# EAGLE board BenchPsu (EAGLE 6.6.0), part 1 of 2
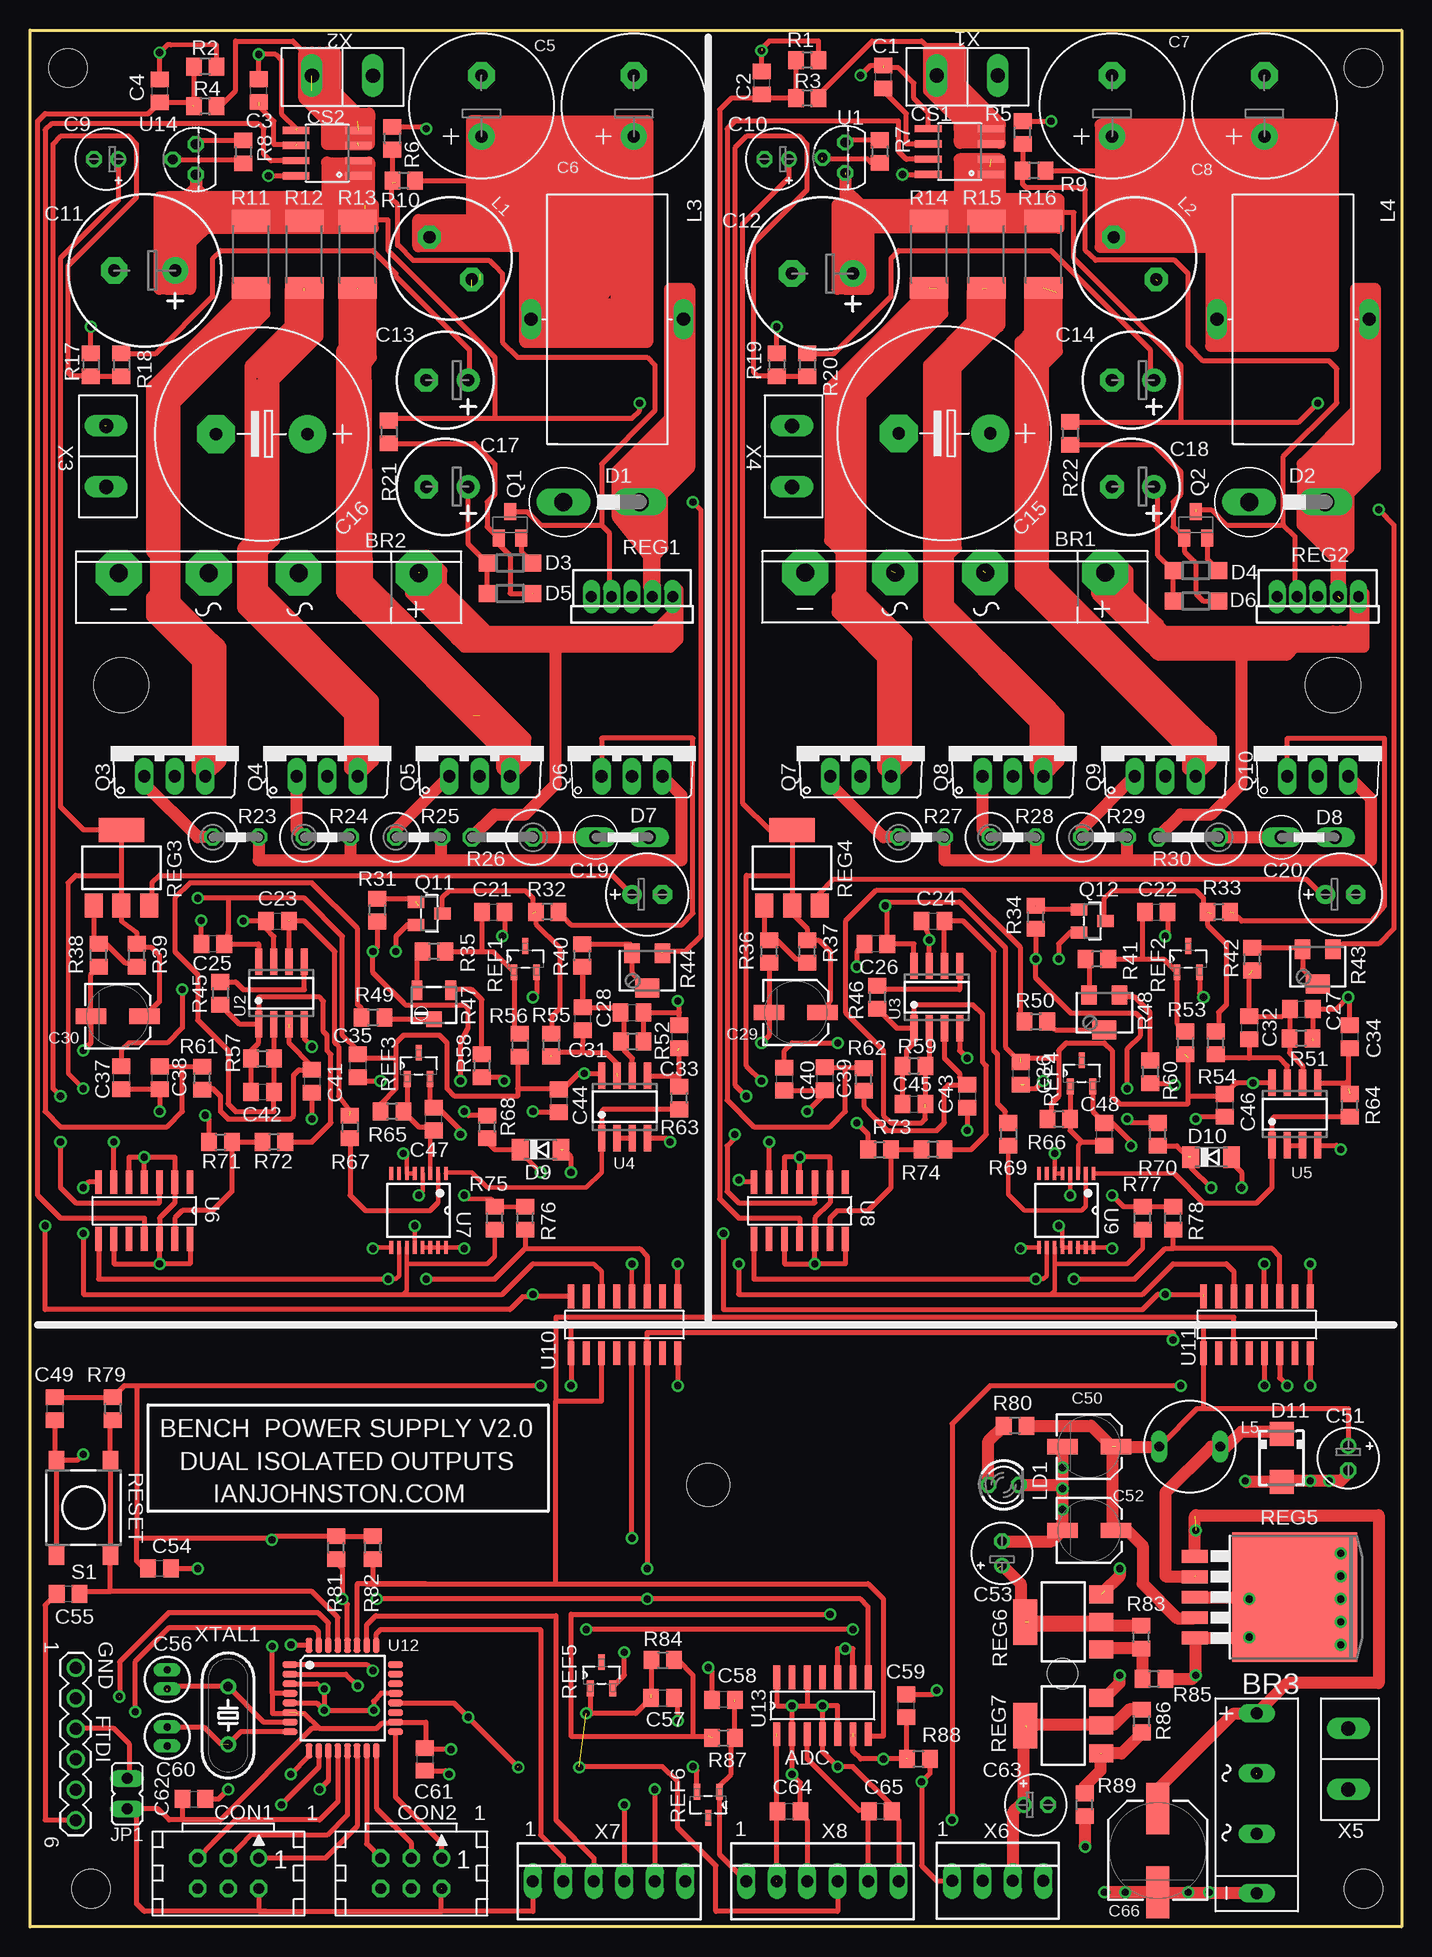
[diagram p2: board, top side]
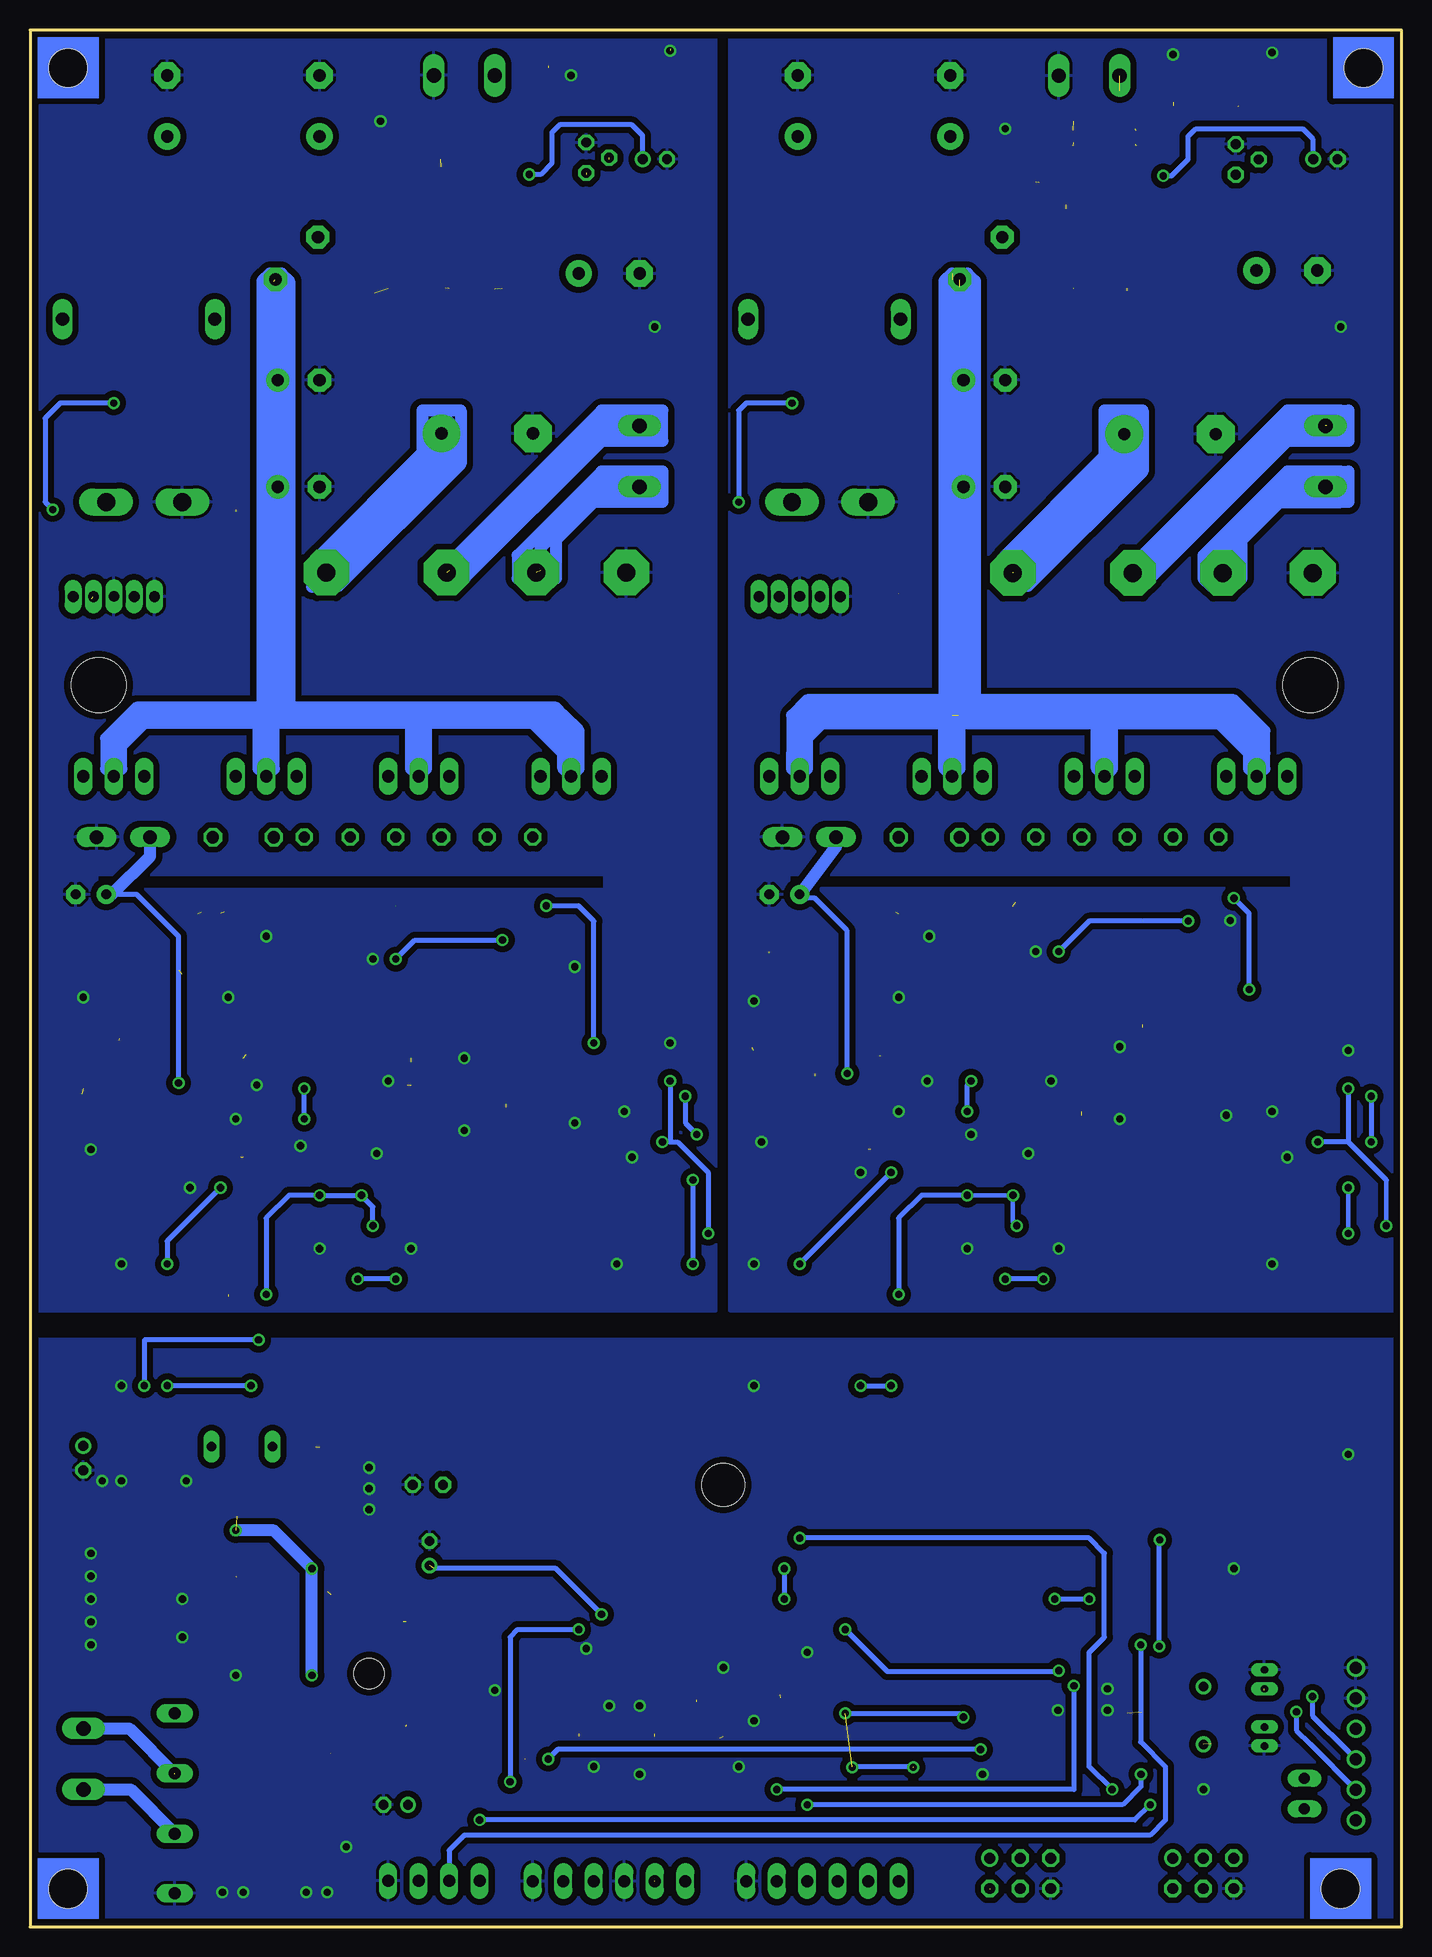
[diagram p3: board, bottom side, seen from below]

Size 114.3 x 158.11 mm. Coordinates in mm from the lower left corner, seen from the top.
Outline: 114.3,158.12 114.3,0 0,0 0,158.12 114.3,158.12
Copper layers (1*16): Top 0.035mm / dielectric 1.5mm / Bottom 0.035mm
Design rules "default": minimum track width 10mil, minimum drill 24mil, track to track 20mil, track to pad 20mil, pad to pad 20mil, via to via 20mil, smd to smd 20mil, copper to edge 22mil, drill to drill 8mil, minimum pad ring 10mil, minimum via ring 8mil, stop-mask expansion 4mil, vias tented up to drill 0mil, thermal gap 10mil
Net classes: 1 vcc: width 0.254 mm; 2 gnd: width 0.254 mm, drill 0.61 mm, clearance 0.254 mm; 3 usbvcc: width 0.254 mm, drill 0.61 mm, clearance 0.254 mm; 4 aref: width 0.254 mm, drill 0.61 mm, clearance 0.254 mm
Holes 3.2 mm at 5.08,3.18 3.17,154.94 111.12,154.94 111.12,3.18
Holes 4.57 mm at 108.58,103.51 7.62,103.51
Holes 3.56 mm at 56.52,36.83
Holes 2.54 mm at 86.04,21.11

## Footprints (pad centres in the part's own frame; a part is rotated, then mirrored left to right if it is on the bottom)
GSIB_15A = drill 1.5 pad 3.81 octagon: + -13.5,-1.27; - 11.494,-1.27; AC1 -3.492,-1.27; AC2 4.001,-1.27
2KBB-R = drill 1.016 long: + -7.62,0; - 7.391,0; AC1 -2.616,0; AC2 2.413,0
C0805 = smd 1.3 x 1.5: 1 -0.95,0; 2 0.95,0
E5,0-12 = drill 1.016 pad 2.184: + -2.54,0 | drill 1.016 pad 2.184 octagon: - 2.54,0
E2-5 = drill 0.813 pad 1.27: + -1.016,0 | drill 0.813 pad 1.27 octagon: - 1.016,0
E-050X125 = drill 1.016 pad 2.184: + -2.54,0 | drill 1.016 pad 2.184 octagon: - 2.54,0
E-035X080 = drill 1.016 pad 1.93: + -1.905,0 | drill 1.016 pad 1.93 octagon: - 1.587,0
E7,5-18 = drill 1.016 pad 3.15: + -3.81,0 | drill 1.016 pad 3.15 octagon: - 3.81,0
E2,5-7 = drill 0.813 pad 1.6: + -1.27,0 | drill 0.813 pad 1.6 octagon: - 1.27,0
SV-C = smd 2.54 x 1.27: + -2.223,0; - 2.223,0
ENP-015-040 = drill 0.61 pad 0.813 long: 1 -0.635,0; 2 0.953,0
SV-E/F = smd 4.318 x 1.93: + -3.493,0; - 3.493,0
CON06 = drill 0.914: 1 -2.54,-1.27 | drill 0.914 octagon: 2 -2.54,1.27; 3 0,-1.27; 4 0,1.27; 5 2.54,-1.27; 6 2.54,1.27
SO08 = smd 0.61 x 2.21: 1 -1.905,-2.616; 2 -0.635,-2.616; 3 0.635,-2.616; 4 1.905,-2.616; 5 1.905,2.616; 6 0.635,2.616; 7 -0.635,2.616; 8 -1.905,2.616
DO-201-15_V = drill 1.499 long: A 5.08,0; C -1.27,0
SOD123 = smd 1.4 x 1.4: A 1.9,0; C -1.9,0
D015-12_V = drill 1.118 long: A 4.445,0; C 0,0
SOD80C = smd 1.4 x 1.8: A 1.7,0; C -1.7,0
SMA = smd 2 x 2: A 2,0; C -2,0
1X06 = drill 1.016: 1 0,0; 2 2.54,0; 3 5.08,0; 4 7.62,0; 5 10.16,0; 6 12.7,0
JP1 = drill 0.914 long: 1 0,-1.27; 2 0,1.27
RS749-8366_THT22UH = drill 1.016 pad 1.93 octagon: 1 -2.5,0; 2 2.5,0
SFT1030 = drill 1.118 long: 1 -6.35,0; 2 6.35,0
0.2PIN_0.3DIA = drill 0.813 long: 1 0,2.54; 2 0,-2.54
LED3MM = drill 0.813 octagon: A -1.27,0; K 1.27,0
SOT23-BEC = smd 1 x 1.4: B -0.95,-1.1; C 0,1.1; E 0.95,-1.1
TO220AV = drill 1.016 long: B -2.54,-2.54; C 0,-2.54; E 2.54,-2.54
TO220V = drill 1.016 long: 1 -2.54,-2.54; 2 0,-2.54; 3 2.54,-2.54
SOT23 = smd 1 x 1.4: 1 -0.95,-1.1; 2 0.95,-1.1; 3 0,1.1
R0805 = smd 1.3 x 1.5: 1 -0.95,0; 2 0.95,0
R2512 = smd 1.8 x 3.2: 1 -2.8,0; 2 2.8,0
0411V = drill 0.914 octagon: 1 -2.54,0; 2 1.27,0
P0613V = drill 1.016 octagon: 1 -2.54,0; 2 2.54,0
SM-42/43W = smd 1.3 x 1.6: 1 -1.27,-1.45; 3 1.27,-1.45 | smd 2 x 1.6: 2 0,1.45
3223W = smd 0.9 x 1.6: 1 -1.4,-1.215; 3 1.4,-1.215 | smd 1.3 x 1.3: 2 0,1.215
SOT95P237X112-3N = smd 1.321 x 0.559: 1 -1.092,0.94; 2 -1.092,-0.94 | smd 1.321 x 0.508: 3 1.092,0
LM2575HV_V_2 = drill 0.9 long: 1 -3.389,0.258; 2 -1.7,0.263; 3 0.011,0.247; 4 1.7,0.263; 5 3.389,0.258
SOT223 = smd 1.5 x 2: 1 -2.3,-3.15; 2 0,-3.15; 3 2.3,-3.15 | smd 3.8 x 2: 4 0,3.15
TO263-5 = smd 1.067 x 2.159: 1 -3.404,-8.331; 2 -1.702,-8.331; 3 0,-8.331; 4 1.702,-8.331; 5 3.404,-8.331 | smd 10.8 x 10.41: 6 0,0
DTSM-6 = smd 1.55 x 1.3: 1 -3.975,2.25; 2 3.975,2.25; 3 -3.975,-2.25; 4 3.975,-2.25
TO92 = drill 0.813 octagon: 1 -1.27,0; 2 0,1.905; 3 1.27,0
SO08' = smd 0.6 x 2.2: 1 -1.905,-2.6; 2 -0.635,-2.6; 3 0.635,-2.6; 4 1.905,-2.6; 5 1.905,2.6; 6 0.635,2.6; 7 -0.635,2.6; 8 -1.905,2.6
SOIC127P600X175-14N = smd 1.981 x 0.559: 1 -2.362,3.81; 2 -2.362,2.54; 3 -2.362,1.27; 4 -2.362,0; 5 -2.362,-1.27; 6 -2.362,-2.54; 7 -2.362,-3.81; 8 2.362,-3.81; 9 2.362,-2.54; 10 2.362,-1.27; 11 2.362,0; 12 2.362,1.27; 13 2.362,2.54; 14 2.362,3.81
TSSOP16 = smd 0.31 x 1.1: 1 -2.275,-3.08; 2 -1.625,-3.08; 3 -0.975,-3.08; 4 -0.325,-3.08; 5 0.325,-3.08; 6 0.975,-3.08; 7 1.625,-3.08; 8 2.275,-3.08; 9 2.275,3.08; 10 1.625,3.08; 11 0.975,3.08; 12 0.325,3.08; 13 -0.325,3.08; 14 -0.975,3.08; 15 -1.625,3.08; 16 -2.275,3.08
SOIC16N = smd 1.981 x 0.559: 1 -2.362,3.81; 2 -2.362,2.54; 3 -2.362,1.27; 4 -2.362,0; 5 -2.362,-1.27; 6 -2.362,-2.54; 7 -2.362,-3.81; 8 -2.362,-5.08; 9 2.362,-5.08; 10 2.362,-3.81; 11 2.362,-2.54; 12 2.362,-1.27; 13 2.362,0; 14 2.362,1.27; 15 2.362,2.54; 16 2.362,3.81
TQFP32A = smd 1.27 x 0.559: 1 -4.4,2.8; 2 -4.4,2; 3 -4.4,1.2; 4 -4.4,0.4; 5 -4.4,-0.4; 6 -4.4,-1.2; 7 -4.4,-2; 8 -4.4,-2.8; 17 4.4,-2.8; 18 4.4,-2; 19 4.4,-1.2; 20 4.4,-0.4; 21 4.4,0.4; 22 4.4,1.2; 23 4.4,2; 24 4.4,2.8 | smd 0.559 x 1.27: 9 -2.8,-4.4; 10 -2,-4.4; 11 -1.2,-4.4; 12 -0.4,-4.4; 13 0.4,-4.4; 14 1.2,-4.4; 15 2,-4.4; 16 2.8,-4.4; 25 2.8,4.4; 26 2,4.4; 27 1.2,4.4; 28 0.4,4.4; 29 -0.4,4.4; 30 -1.2,4.4; 31 -2,4.4; 32 -2.8,4.4
W237-132 = drill 1.194 long: 1 -2.54,-0.635; 2 2.54,-0.635
22-23-2041 = drill 1 long: 1 -3.81,0; 2 -1.27,0; 3 1.27,0; 4 3.81,0
22-23-2061 = drill 1 long: 1 -6.35,0; 2 -3.81,0; 3 -1.27,0; 4 1.27,0; 5 3.81,0; 6 6.35,0
HC49/S@1 = drill 0.813: 1 -2.413,0; 2 2.413,0

## Placement (x,y rotation side)
BR1  15A 600V  [GSIB_15A]  76.1,111.63 180 top
BR2  15A 600V  [GSIB_15A]  18.89,111.59 180 top
BR3  2KBB05R  [2KBB-R]  102.23,10.18 270 top
C1  0.1uF  [C0805]  71.12,154.2 90 top
C2  0.1uF  [C0805]  60.96,153.69 270 top
C3  0.1uF  [C0805]  19.05,153.06 90 top
C4  0.1uF  [C0805]  10.79,153.03 270 top
C5  1000uF 50V  [E5,0-12]  37.62,151.79 90 top
C6  1000uF 50V  [E5,0-12]  50.32,151.79 90 top
C7  1000uF 50V  [E5,0-12]  90.17,151.79 90 top
C8  1000uF 50V  [E5,0-12]  102.87,151.79 90 top
C9  0.1uF  [E2-5]  6.35,147.34 180 top
C10  0.1uF  [E2-5]  62.23,147.34 180 top
C11  100uF 50V  [E-050X125]  9.56,138.07 180 top
C12  100uF 50V  [E-050X125]  66.04,137.82 180 top
C13  100uF 50V  [E-035X080]  34.61,128.93 180 top
C14  100uF 50V  [E-035X080]  91.76,128.93 180 top
C15  3300uF 50V  [E7,5-18]  76.2,124.48 180 top
C16  3300uF 50V  [E7,5-18]  19.31,124.44 180 top
C17  100uF 50V  [E-035X080]  34.61,120.04 180 top
C18  100uF 50V  [E-035X080]  91.76,120.04 180 top
C19  47uF 63V  [E2,5-7]  51.44,86.06 0 top
C20  47uF 63V  [E2,5-7]  109.22,86.06 0 top
C21  .1uF  [C0805]  38.61,84.6 0 top
C22  .1uF  [C0805]  93.85,84.6 0 top
C23  10n  [C0805]  20.63,83.84 0 top
C24  10n  [C0805]  75.25,83.84 0 top
C25  0.1uF  [C0805]  15.24,81.94 180 top
C26  0.1uF  [C0805]  70.48,81.94 180 top
C27  470pF  [C0805]  105.95,76.52 0 top
C28  470pF  [C0805]  50.16,76.22 0 top
C29  47uF 16V  [SV-C]  63.82,76.22 180 top
C30  47uF 16V  [SV-C]  7.3,75.9 180 top
C31  470pF  [C0805]  46.05,75.71 270 top
C32  470pF  [C0805]  101.6,74.95 270 top
C33  .1uF  [C0805]  54.12,74.19 270 top
C34  .1uF  [C0805]  109.98,74.19 270 top
C35  0.1uF  [C0805]  27.3,71.78 270 top
C36  0.1uF  [C0805]  82.55,71.14 270 top
C37  0.1uF  [C0805]  7.6,70.78 270 top
C38  0.1uF  [C0805]  10.79,70.77 270 top
C39  0.1uF  [C0805]  66.23,70.7 270 top
C40  0.1uF  [C0805]  62.87,70.67 270 top
C41  .1uF  [C0805]  23.5,70.48 270 top
C42  0.1uF  [C0805]  19.37,69.61 0 top
C43  .1uF  [C0805]  78.11,69.24 270 top
C44  .1uF  [C0805]  44.07,68.86 270 top
C45  0.1uF  [C0805]  73.66,68.6 0 top
C46  .1uF  [C0805]  99.57,68.48 270 top
C47  .1uF  [C0805]  33.66,67.33 90 top
C48  .1uF  [C0805]  89.53,66.06 90 top
C49  .1uF  [C0805]  2.06,43.2 270 top
C50  47uF 16V  [SV-C]  88.27,40.03 180 top
C51  220uF 10v  [E2-5]  109.86,39.07 270 top
C52  47uF 16V  [SV-C]  88.27,33.04 180 top
C53  10uF 25V  [E2-5]  81,31.14 90 top
C54  0.1uF  [C0805]  10.79,29.87 180 top
C55  100nF  [C0805]  3.17,27.78 0 top
C56  22pF  [ENP-015-040]  11.43,20.8 270 top
C57  .1uF  [C0805]  52.7,19.09 0 top
C58  .1uF  [C0805]  57.78,18.95 180 top
C59  0.1uF  [C0805]  73.03,18.44 90 top
C60  22pF  [ENP-015-040]  11.43,15.72 90 top
C61  0.1uF  [C0805]  32.89,13.97 270 top
C62  .1uF  [C0805]  13.65,10.66 0 top
C63  10uF 25V  [E2-5]  83.82,10.18 0 top
C64  0.1uF  [C0805]  63.25,9.65 0 top
C65  0.1uF  [C0805]  70.87,9.65 0 top
C66  100uF 40V  [SV-E/F]  93.98,6.37 270 top
CON1  6-way DIL Male  [CON06]  16.53,4.47 180 top
CON2  6-way DIL Male  [CON06]  31.77,4.47 180 top
CS1  ACS712  [SO08]  77.47,147.98 90 top
CS2  ACS712  [SO08]  24.77,147.85 90 top
D1  MBR360  [DO-201-15_V]  49.53,118.77 180 top
D2  MBR360  [DO-201-15_V]  106.68,118.77 180 top
D3  2V7  [SOD123]  40.01,113.69 0 top
D4  2V7  [SOD123]  97.16,113.05 0 top
D5  1N4148  [SOD123]  40.01,111.15 0 top
D6  1N4148  [SOD123]  97.16,110.51 0 top
D7  30V  [D015-12_V]  47.15,90.83 0 top
D8  30V  [D015-12_V]  104.3,90.83 0 top
D9  4V7 500mW  [SOD80C]  42.55,64.79 0 top
D10  4V7 500mW  [SOD80C]  98.42,64.16 0 top
D11  MBRA340T3  [SMA]  104.3,39.07 270 top
FTDI  FTDI Basic  [1X06]  3.81,8.89 90 top
JP1  Solder link  [JP1]  8.1,11.11 0 top
L1  22uH 3.7A  [RS749-8366_THT22UH]  35.05,139.09 315 top
L2  22uH 3.7A  [RS749-8366_THT22UH]  92.08,139.09 315 top
L3  150uH 3A  [SFT1030]  48.1,134.01 180 top
L4  150uH 3A  [SFT1030]  105.25,134.01 180 top
L5  494HYF-0134K  [0.2PIN_0.3DIA]  96.64,40.03 270 top
LD1  3mm Red  [LED3MM]  81.14,36.85 0 top
Q1  2N3906  [SOT23-BEC]  40.01,116.86 0 top
Q2  2N3906  [SOT23-BEC]  97.16,116.86 0 top
Q3  MJE3055  [TO220AV]  12.06,98.45 0 top
Q4  MJE3055  [TO220AV]  24.77,98.45 0 top
Q5  MJE3055  [TO220AV]  37.47,98.45 0 top
Q6  TIP31C  [TO220V]  50.16,98.45 0 top
Q7  MJE3055  [TO220AV]  69.22,98.45 0 top
Q8  MJE3055  [TO220AV]  81.92,98.45 0 top
Q9  MJE3055  [TO220AV]  94.61,98.45 0 top
Q10  TIP31C  [TO220V]  107.31,98.45 0 top
Q11  BC847B  [SOT23]  33.27,84.48 270 top
Q12  BC847B  [SOT23]  88.52,83.84 270 top
R1  2K  [R0805]  64.77,155.6 180 top
R2  2K  [R0805]  14.61,155.07 180 top
R3  10K  [R0805]  64.77,152.42 180 top
R4  10K  [R0805]  14.61,151.76 180 top
R5  1K  [R0805]  82.71,149.56 90 top
R6  1K  [R0805]  30.2,149.08 90 top
R7  6.8ohm  [R0805]  70.8,147.98 270 top
R8  6.8ohm  [R0805]  17.78,147.95 270 top
R9  22K  [R0805]  83.66,146.39 180 top
R10  22K  [R0805]  31.15,145.54 180 top
R11  0.015ohm 3W  [R2512]  18.41,139.4 90 top
R12  0.015ohm 3W  [R2512]  22.86,139.4 90 top
R13  0.015ohm 3W  [R2512]  27.3,139.4 90 top
R14  0.015ohm 3W  [R2512]  74.93,139.4 90 top
R15  0.015ohm 3W  [R2512]  79.69,139.4 90 top
R16  0.015ohm 3W  [R2512]  84.45,139.4 90 top
R17  1K  [R0805]  5.08,130.2 270 top
R18  10K  [R0805]  7.62,130.2 270 top
R19  1K  [R0805]  62.23,130.2 270 top
R20  10K  [R0805]  64.77,130.2 270 top
R21  10K  [R0805]  29.91,124.61 270 top
R22  10K  [R0805]  86.68,124.48 270 top
R23  39ohm 1W  [0411V]  17.78,90.83 0 top
R24  39ohm 1W  [0411V]  25.4,90.83 0 top
R25  39ohm 1W  [0411V]  33.02,90.83 0 top
R26  270ohm 2W  [P0613V]  39.37,90.83 180 top
R27  39ohm 1W  [0411V]  74.93,90.83 0 top
R28  39ohm 1W  [0411V]  82.55,90.83 0 top
R29  39ohm 1W  [0411V]  90.17,90.83 0 top
R30  270ohm 2W  [P0613V]  96.52,90.83 180 top
R31  10K  [R0805]  28.95,84.76 90 top
R32  100R  [R0805]  43.1,84.61 180 top
R33  100R  [R0805]  99.06,84.58 180 top
R34  10K  [R0805]  83.82,84.16 90 top
R35  1K  [R0805]  33.66,81.3 180 top
R36  681ohm  [R0805]  61.59,81.3 90 top
R37  220ohm  [R0805]  64.77,81.3 90 top
R38  681ohm  [R0805]  5.71,80.98 90 top
R39  220ohm  [R0805]  8.89,80.98 90 top
R40  8.2K  [R0805]  46.02,80.97 90 top
R41  1K  [R0805]  88.9,80.67 180 top
R42  8.2K  [R0805]  101.85,80.67 90 top
R43  2K  [SM-42/43W]  107.31,80.03 180 top
R44  2K  [SM-42/43W]  51.44,79.71 180 top
R45  1K  [R0805]  15.86,77.81 270 top
R46  1K  [R0805]  70.61,77.49 270 top
R47  1K  [3223W]  33.66,76.86 180 top
R48  1K  [SM-42/43W]  89.53,76.22 180 top
R49  5K  [R0805]  28.57,75.82 0 top
R50  5K  [R0805]  83.82,75.46 0 top
R51  2.2K  [R0805]  105.92,74.06 180 top
R52  2.2K  [R0805]  50.18,73.79 180 top
R53  10K  [R0805]  96.27,73.68 270 top
R54  4K7  [R0805]  98.81,73.68 90 top
R55  4K7  [R0805]  43.46,73.51 90 top
R56  10K  [R0805]  40.83,73.5 270 top
R57  22K  [R0805]  19.37,72.39 0 top
R58  2K  [R0805]  37.66,71.78 270 top
R59  22K  [R0805]  73.66,71.78 0 top
R60  2K  [R0805]  93.34,71.27 270 top
R61  1K  [R0805]  14.35,70.74 90 top
R62  1K  [R0805]  69.47,70.63 90 top
R63  4.7K  [R0805]  54.1,69.09 90 top
R64  4.7K  [R0805]  109.98,68.48 90 top
R65  10K  [R0805]  30.16,67.97 180 top
R66  10K  [R0805]  85.72,67.33 180 top
R67  1K  [R0805]  26.67,66.68 270 top
R68  2K2  [R0805]  38.1,66.68 90 top
R69  1K  [R0805]  81.53,66.06 270 top
R70  2K2  [R0805]  93.98,66.06 90 top
R71  5K  [R0805]  15.88,65.43 0 top
R72  8K2  [R0805]  20.32,65.43 180 top
R73  5K  [R0805]  70.8,64.79 0 top
R74  8K2  [R0805]  75.25,64.79 180 top
R75  3K  [R0805]  38.73,59.08 90 top
R76  3K  [R0805]  41.27,59.08 90 top
R77  3K  [R0805]  92.71,59.08 90 top
R78  3K  [R0805]  95.25,59.08 90 top
R79  1K  [R0805]  6.91,43.2 90 top
R80  330  [R0805]  82.1,41.77 180 top
R81  3K  [R0805]  25.5,31.61 90 top
R82  3K  [R0805]  28.55,31.61 90 top
R83  220ohm  [R0805]  92.61,24.15 90 top
R84  10K  [R0805]  52.73,22.25 0 top
R85  3.9K  [R0805]  93.67,20.66 180 top
R86  220ohm  [R0805]  92.65,17.17 90 top
R87  15K  [R0805]  57.78,15.77 0 top
R88  10K  [R0805]  74.04,13.99 180 top
R89  2K  [R0805]  87.88,10.18 90 top
REF1  LM4050 5V  [SOT95P237X112-3N]  41.27,80.67 90 top
REF2  LM4050 5V  [SOT95P237X112-3N]  96.52,80.67 90 top
REF3  LM4050 5V  [SOT95P237X112-3N]  32.38,71.78 90 top
REF4  LM4050 5V  [SOT95P237X112-3N]  87.63,71.14 90 top
REF5  LM4050 5V  [SOT95P237X112-3N]  47.62,20.98 90 top
REF6  LM4040 2.048V  [SOT95P237X112-3N]  56.52,10.18 270 top
REG1  LM2576-ADJ  [LM2575HV_V_2]  50.16,111.15 180 top
REG2  LM2576-ADJ  [LM2575HV_V_2]  107.31,111.15 180 top
REG3  LM317MSTT3  [SOT223]  7.62,88.29 0 top
REG4  LM317MSTT3  [SOT223]  63.5,88.29 0 top
REG5  LM2575HVSMD  [TO263-5]  105.41,27.49 270 top
REG6  LM317MSTT3  [SOT223]  86.11,25.42 90 top
REG7  LM317MSTT3  [SOT223]  86.11,16.79 90 top
S1  DTSM-6  [DTSM-6]  4.45,34.95 90 top
U1  LM334Z  [TO92]  67.94,147.47 90 top
U2  OP295  [SO08']  20.95,77.84 0 top
U3  OP295  [SO08']  75.56,77.49 0 top
U4  OP295  [SO08']  49.56,68.35 0 top
U5  OP295  [SO08']  105.41,67.75 0 top
U6  MCP3424-E/SL  [SOIC127P600X175-14N]  9.53,59.71 270 top
U7  DAC8574IPW  [TSSOP16]  32.38,59.71 180 top
U8  MCP3424-E/SL  [SOIC127P600X175-14N]  64.14,59.71 270 top
U9  DAC8574IPW  [TSSOP16]  86.36,59.71 180 top
U10  SI8600XSI8605  [SOIC16N]  48.9,50.19 90 top
U11  SI8600XSI8605  [SOIC16N]  101.6,50.19 90 top
U12  ATMEGA328P-A  [TQFP32A]  26.06,19.07 0 top
U13  MCP3424-E/SL  [SOIC127P600X175-14N]  66.04,18.44 90 top
U14  LM334Z  [TO92]  13.81,147.32 90 top
X1  2-way  [W237-132]  78.11,153.69 180 top
X2  2-way  [W237-132]  26.04,153.67 180 top
X3  2-way  [W237-132]  6.99,122.58 270 top
X4  2-way  [W237-132]  64.14,122.58 270 top
X5  2-way  [W237-132]  110.49,13.99 270 top
X6  4-way SIL Pol  [22-23-2041]  80.64,3.83 0 top
X7  6-way SIL Pol  [22-23-2061]  48.26,3.81 0 top
X8  6-way SIL Pol  [22-23-2061]  66.04,3.81 0 top
XTAL1  16MhZ  [HC49/S@1]  16.51,17.62 90 top